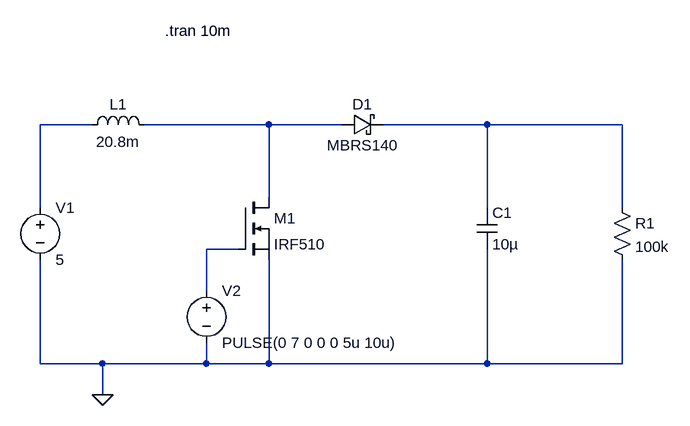
[diagram p0: schematic Boost Converter Circuit.asc]
Boost Converter Circuit.asc, the LTspice schematic file:
Version 4
SHEET 1 1128 680
WIRE 224 192 144 192
WIRE 496 192 304 192
WIRE 608 192 496 192
WIRE 832 192 672 192
WIRE 1040 192 832 192
WIRE 496 304 496 192
WIRE 144 320 144 192
WIRE 832 320 832 192
WIRE 1040 320 1040 192
WIRE 448 384 400 384
WIRE 400 448 400 384
WIRE 144 560 144 400
WIRE 240 560 144 560
WIRE 400 560 400 528
WIRE 400 560 240 560
WIRE 496 560 496 400
WIRE 496 560 400 560
WIRE 832 560 832 384
WIRE 832 560 496 560
WIRE 1040 560 1040 400
WIRE 1040 560 832 560
WIRE 240 608 240 560
FLAG 240 608 0
SYMBOL ind 208 208 R270
WINDOW 0 32 56 VTop 2
WINDOW 3 5 56 VBottom 2
SYMATTR InstName L1
SYMATTR Value 20.8m
SYMBOL nmos 448 304 R0
SYMATTR InstName M1
SYMATTR Value IRF510
SYMBOL voltage 144 304 R0
WINDOW 123 0 0 Left 0
WINDOW 39 0 0 Left 0
SYMATTR InstName V1
SYMATTR Value 5
SYMBOL voltage 400 432 R0
WINDOW 123 0 0 Left 0
WINDOW 39 0 0 Left 0
SYMATTR InstName V2
SYMATTR Value PULSE(0 7 0 0 0 5u 10u)
SYMBOL schottky 608 208 R270
WINDOW 0 32 32 VTop 2
WINDOW 3 0 32 VBottom 2
SYMATTR InstName D1
SYMATTR Value MBRS140
SYMATTR Description Diode
SYMATTR Type diode
SYMBOL cap 816 320 R0
SYMATTR InstName C1
SYMATTR Value 10µ
SYMBOL res 1024 304 R0
SYMATTR InstName R1
SYMATTR Value 100k
TEXT 336 48 Left 2 !.tran 10m

The netlist it stands for:
* Boost Converter Circuit.asc
L1 N001 N002 20.8m
M1 N002 N004 0 0 IRF510
V1 N001 0 5
V2 N004 0 PULSE(0 7 0 0 0 5u 10u)
D1 N002 N003 MBRS140
C1 N003 0 10µ
R1 N003 0 100k
.model D D
.lib standard.dio
.model NMOS NMOS
.model PMOS PMOS
.lib standard.mos
.tran 10m
.backanno
.end